# Altium schematic sheet front_raspicams.SchDoc: Camera
size A4; Organization: GPA Robotics; DocumentNumber: 6; Revision: REV 0; SheetNumber: 6; SheetTotal: 11
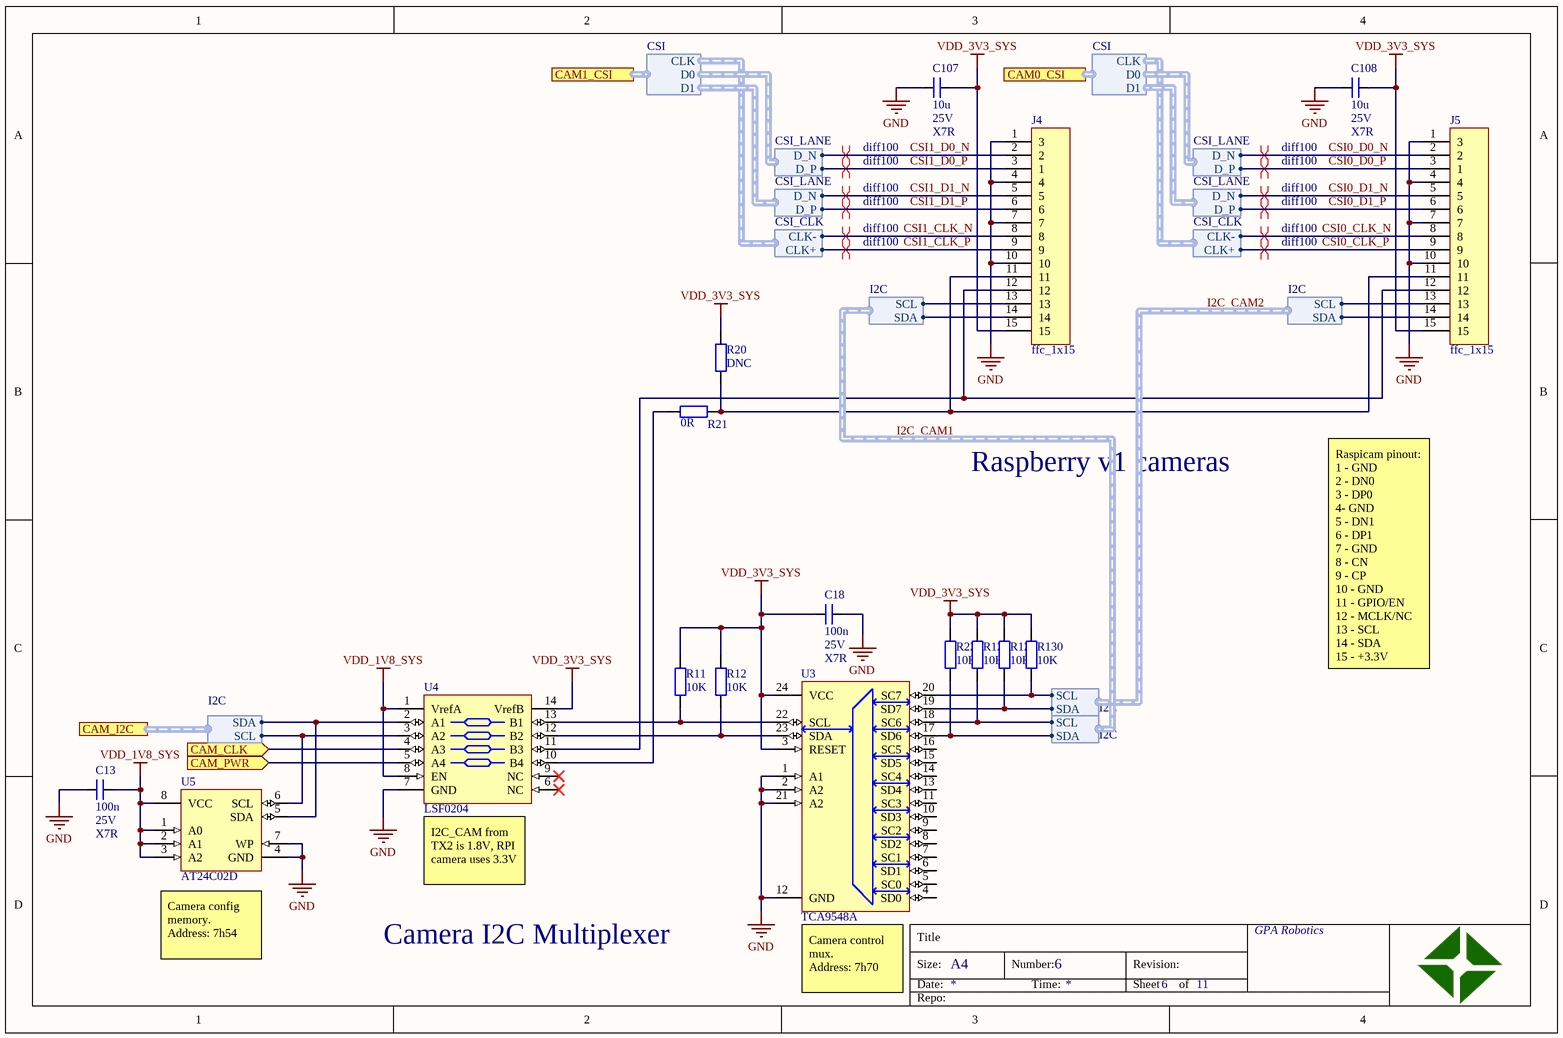
[diagram p0: front_raspicams.SchDoc]

## Parts
C13  value 100n  Voltage: 25V  Type: X7R  [C1005[0402]]  (hidden comment: cap)
C18  value 100n  Voltage: 25V  Type: X7R  [C1005[0402]]  (hidden comment: cap)
C107  value 10u  Voltage: 25V  Type: X7R  [C3216[1206]]  (hidden comment: cap)
C108  value 10u  Voltage: 25V  Type: X7R  [C3216[1206]]  (hidden comment: cap)
J4  ffc_1x15  [fci_ffc_1mm_1x15]
J5  ffc_1x15  [fci_ffc_1mm_1x15]
R11  value 10K  [R1005[0402]]  (hidden comment: res)
R12  value 10K  [R1005[0402]]  (hidden comment: res)
R20  value DNC  [R1005[0402]]  (hidden comment: res)
R21  value 0R  [R1005[0402]]  (hidden comment: res)
R22  value 10K  [R1005[0402]]  (hidden comment: res)
R128  value 10K  [R1005[0402]]  (hidden comment: res)
R129  value 10K  [R1005[0402]]  (hidden comment: res)
R130  value 10K  [R1005[0402]]  (hidden comment: res)
U3  TCA9548A  [TI_TSOP65P640X120-24N]
U4  LSF0204  [TI_TSOP65P640X120-14N]
U5  AT24C02D  [AT_TSOP65P640X120-8N]

## Ports
CAM0_CSI (harness CSI), CAM1_CSI (harness CSI), CAM_CLK (in), CAM_I2C (harness I2C), CAM_PWR (in)

## Harnesses
I2C: SCL, SDA
CSI: CLK, D0, D1
CSI_LANE: D_P, D_N
CSI_CLK: CLK-, CLK+

## Nets
GND: C13.2 C18.1 C107.2 C108.2 J4.1(3) J4.4 J4.7 J4.10 J5.1(3) J5.4 J5.7 J5.10 U3.1(A1) U3.2(A2) U3.12(GND) U3.21(A2) U4.7(GND) U5.4(GND) U5.7(WP)
VDD_1V8_SYS: C13.1 U4.1(VrefA) U4.8(EN) U5.1(A0) U5.2(A1) U5.3(A2) U5.8(VCC)
VDD_3V3_SYS: C18.2 C107.1 C108.1 J4.15 J5.15 R11.2 R12.2 R20.1 R22.2 R128.2 R129.2 R130.2 U3.3(RESET) U3.24(VCC) U4.14(VrefB)
CAM_CLK: U4.4(A3) ; port CAM_CLK
CAM_PWR: U4.5(A4) ; port CAM_PWR
CSI0_CLK_N: J5.8 ; harness CSI_CLK.CLK-
CSI0_CLK_P: J5.9 ; harness CSI_CLK.CLK+
CSI0_D0_N: J5.2 ; harness CSI_LANE.D_N
CSI0_D0_P: J5.3(1) ; harness CSI_LANE.D_P
CSI0_D1_N: J5.5 ; harness CSI_LANE.D_N
CSI0_D1_P: J5.6 ; harness CSI_LANE.D_P
CSI1_CLK_N: J4.8 ; harness CSI_CLK.CLK-
CSI1_CLK_P: J4.9 ; harness CSI_CLK.CLK+
CSI1_D0_N: J4.2 ; harness CSI_LANE.D_N
CSI1_D0_P: J4.3(1) ; harness CSI_LANE.D_P
CSI1_D1_N: J4.5 ; harness CSI_LANE.D_N
CSI1_D1_P: J4.6 ; harness CSI_LANE.D_P
I2C_CAM1.SCL: J4.13 R128.1 U3.18(SC6) ; harness I2C.SCL
I2C_CAM1.SDA: J4.14 R22.1 U3.17(SD6) ; harness I2C.SDA
I2C_CAM2.SCL: J5.13 R130.1 U3.20(SC7) ; harness I2C.SCL
I2C_CAM2.SDA: J5.14 R129.1 U3.19(SD7) ; harness I2C.SDA
NetJ4_11: J4.11 J5.11 R20.2 R21.1
NetJ4_12: J4.12 J5.12 U4.11(B3)
NetR11_1: R11.1 U3.22(SCL) U4.13(B1)
NetR12_1: R12.1 U3.23(SDA) U4.12(B2)
NetR21_2: R21.2 U4.10(B4)
NetU4_2: U4.2(A1) U5.5(SDA) ; port CAM_I2C.SDA
NetU4_3: U4.3(A2) U5.6(SCL) ; port CAM_I2C.SCL

Not connected (* = marked no-connect by the designer): U3 4(SD0) 5(SC0) 6(SD1) 7(SC1) 8(SD2) 9(SC2) 10(SD3) 11(SC3) 13(SD4) 14(SC4) 15(SD5) 16(SC5); U4 6(NC)* 9(NC)*

## Layout directives
differential pair; net class diff100: CSI0_CLK_N, CSI0_CLK_P, CSI0_D0_N, CSI0_D0_P, CSI0_D1_N, CSI0_D1_P, CSI1_CLK_N, CSI1_CLK_P, CSI1_D0_N, CSI1_D0_P, CSI1_D1_N, CSI1_D1_P

## Notes on the sheet
- Raspberry v1 cameras
- Raspicam pinout:
  1 - GND
  2 - DN0
  3 - DP0
  4- GND
  5 - DN1
  6 - DP1
  7 - GND
  8 - CN
  9 - CP
  10 - GND
  11 - GPIO/EN
  12 - MCLK/NC
  13 - SCL
  14 - SDA
  15 - +3.3V
- (near U4) I2C_CAM from TX2 is 1.8V, RPI camera uses 3.3V
- (near U5) Camera config memory.
  Address: 7h54
- Camera I2C Multiplexer
- (near U3) Camera control mux.
  Address: 7h70
- Title
- Size:
- Date:
- A4
- Number:
- Time:
- Revision:
- Sheet
- of
- Repo:

## Library data of the parts
C13 C18 C107 C108 = cap: Capacitor; Manufacturer: *; Series: *
R11 R12 R20 R21 = res: Resistor
R22 R128-R130 = res: Resistor; Tolerance: 5%